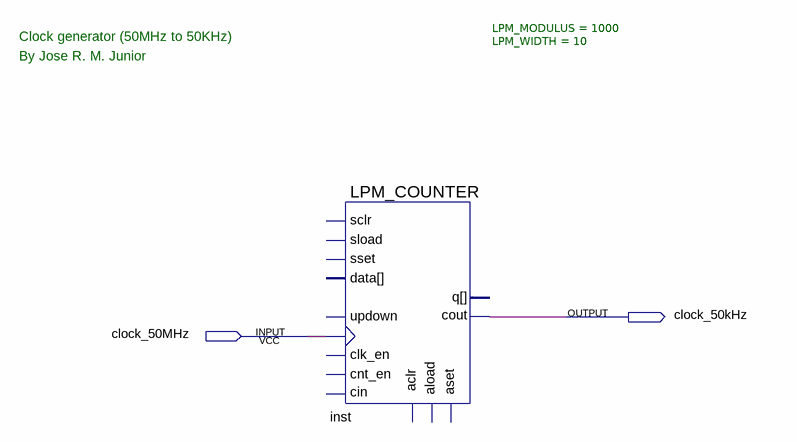
[diagram p0: schematic sheet]
// Quartus schematic clock_divider_50k.bdf as structural Verilog: 1 symbols, 2 pins
module clock_divider_50k (
  input  clock_50MHz,
  output clock_50kHz
);

  LPM_COUNTER #(.LPM_MODULUS(1000), .LPM_WIDTH(10)) inst (
    .clock(clock_50MHz), .cout(clock_50kHz));  // open: sload, data, clk_en, aload, aclr, aset, cin, sset, updown, cnt_en, sclr, q

  // Notes on the sheet:
  //   Clock generator (50MHz to 50KHz)
  //   By Jose R. M. Junior
endmodule
